# Altium schematic sheet POWER_SUPPLY.SchDoc
size A4
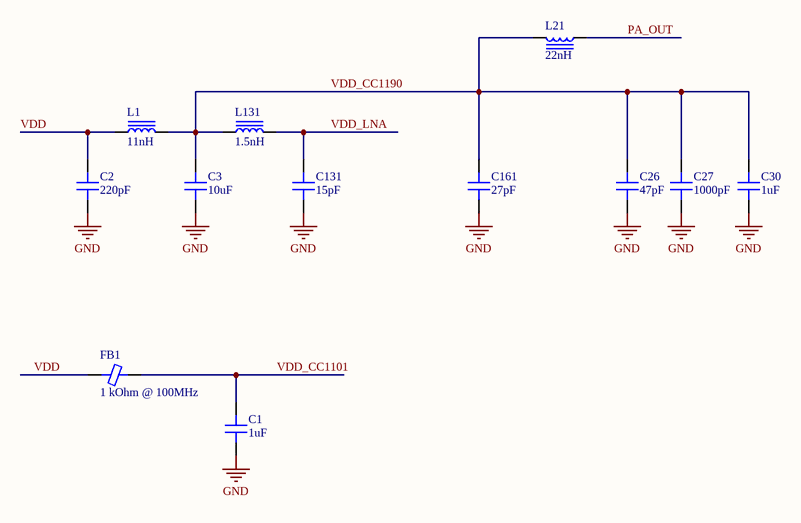
[diagram p0: POWER_SUPPLY.SchDoc]

## Parts
C1  1uF  [CAP 0402/1005]
C2  220pF  [CAP 0402/1005]
C3  10uF  [CAP 0402/1005]
C26  47pF  [CAP 0402/1005]
C27  1000pF  [CAP 0402/1005]
C30  1uF  [CAP 0402/1005]
C131  15pF  [CAP 0402/1005]
C161  27pF  [CAP 0402/1005]
FB1  1 kOhm @ 100MHz  [FER 0402/1005]
L1  11nH  [IND 0402/1005 RF WW]
L21  22nH  [IND 0402/1005 RF WW]
L131  1.5nH  [IND 0402/1005 RF WW]

## Nets
GND: C1.1 C2.1 C3.1 C26.1 C27.1 C30.1 C131.1 C161.1
PA_OUT: L21.1
VDD: C2.2 FB1.1 L1.1
VDD_CC1101: C1.2 FB1.2
VDD_CC1190: C3.2 C26.2 C27.2 C30.2 C161.2 L1.2 L21.2 L131.1
VDD_LNA: C131.2 L131.2

## Library data of the parts
C1 C30 = GRM155R60J105KE19D: CAP CER 1UF 6.3V X5R 0402; Manufacturer: Murata Electronics North America; TemperatureRange: -55C ~ 85C; Tolerance: 10%; Value: 1uF; Part Number: GRM155R60J105KE19D; PartId: 12330; Supplier 1: Digi-Key; Supplier Part Number 1: 490-1320-2-ND; ComponentLink1Description: Datasheet; ComponentLink1URL: http://www.murata.com/~/media/webrenewal/support/library/catalog/products/capacitor/mlcc/c02e.pdf; ComponentLink2Description: Digi-Key Listing; ComponentLink2URL: https://www.digikey.com/product-detail/en/murata-electronics-north-america/GRM155R60J105KE19D/490-1320-2-ND/587208; TemperatureCoefficient: X5R; Voltage: 6.3V; Price: 0,006; Device Package: 0402 (1005 Metric)
C2 = GCM1555C1H221JA16D: CAP CER 220PF 50V NP0 0402; Manufacturer: Murata Electronics North America; TemperatureRange: -55C ~ 125C; TemperatureCoefficient: C0G, NP0; Tolerance: 5%; Value: 220pF; Part Number: GCM1555C1H221JA16D; PartId: 12828; Supplier 1: Digi-Key; Supplier Part Number 1: 490-4927-2-ND; ComponentLink1Description: Datasheet; ComponentLink1URL: http://www.murata.com/~/media/webrenewal/support/library/catalog/products/capacitor/mlcc/c03e.ashx; ComponentLink2Description: Digi-Key Listing; ComponentLink2URL: https://www.digikey.com/product-detail/en/murata-electronics-north-america/GCM1555C1H221JA16D/490-4927-2-ND/1765175; Voltage: 50V; Price: 0,0109; Device Package: 0402 (1005 Metric)
C3 = C1005X5R0J106M050BC: CAP CER 10UF 6.3V X5R 0402; Manufacturer: TDK Corporation; TemperatureRange: -55C ~ 85C; Tolerance: 20%; Value: 10uF; Part Number: C1005X5R0J106M050BC; PartId: 12380; Supplier 1: Digi-Key; Supplier Part Number 1: 445-8920-2-ND; ComponentLink1Description: Datasheet; ComponentLink1URL: https://product.tdk.com/info/en/catalog/datasheets/mlcc_commercial_general_en.pdf; ComponentLink2Description: Digi-Key Listing; ComponentLink2URL: https://www.digikey.com/product-detail/en/tdk-corporation/C1005X5R0J106M050BC/445-8920-2-ND/3507809; TemperatureCoefficient: X5R; Voltage: 6.3V; Price: 0,119; Device Package: 0402 (1005 Metric)
C26 = GRM1555C1H470JA01D: CAP CER 47PF 50V NP0 0402; Manufacturer: Murata Electronics North America; TemperatureRange: -55C ~ 125C; TemperatureCoefficient: C0G, NP0; Tolerance: 5%; Value: 47pF; Part Number: GRM1555C1H470JA01D; PartId: 4827; Supplier 1: Digi-Key; Supplier Part Number 1: 490-5942-2-ND; ComponentLink1Description: Datasheet; ComponentLink1URL: http://www.murata.com/~/media/webrenewal/support/library/catalog/products/capacitor/mlcc/c02e.ashx; ComponentLink2Description: Digi-Key listing; ComponentLink2URL: http://digikey.com/product-detail/en/GRM1555C1H470JA01D/490-5942-2-ND/3693853; Voltage: 50V; Price: 0,0033; Type: -; Device Package: 0402 (1005 Metric)
C27 = GRM1555C1H102JA01D: CAP CER 1000PF 50V NP0 0402; Manufacturer: Murata Electronics North America; TemperatureRange: -55C ~ 125C; TemperatureCoefficient: C0G, NP0; Tolerance: 5%; Value: 1000pF; Part Number: GRM1555C1H102JA01D; PartId: 5126; Supplier 1: Digi-Key; Supplier Part Number 1: 490-3244-2-ND; ComponentLink1Description: Datasheet; ComponentLink1URL: http://www.murata.com/~/media/webrenewal/support/library/catalog/products/capacitor/mlcc/c02e.ashx; ComponentLink2Description: Digi-Key listing; ComponentLink2URL: http://digikey.com/product-detail/en/GRM1555C1H102JA01D/490-3244-2-ND/702509; Voltage: 50V; Price: 0,0164; Type: -; Device Package: 0402 (1005 Metric)
C131 = GRM1555C1H150JA01D: CAP CER 15PF 50V NP0 0402; Manufacturer: Murata Electronics North America; TemperatureRange: -55C ~ 125C; TemperatureCoefficient: C0G, NP0; Tolerance: 5%; Value: 15pF; Part Number: GRM1555C1H150JA01D; PartId: 4811; Supplier 1: Digi-Key; Supplier Part Number 1: 490-5888-2-ND; ComponentLink1Description: Datasheet; ComponentLink1URL: http://www.murata.com/~/media/webrenewal/support/library/catalog/products/capacitor/mlcc/c02e.ashx; ComponentLink2Description: Digi-Key listing; ComponentLink2URL: http://digikey.com/product-detail/en/GRM1555C1H150JA01D/490-5888-2-ND/2791374; Voltage: 50V; Price: 0,0032; Type: -; Device Package: 0402 (1005 Metric)
C161 = GRM1555C1H270JA01D: CAP CER 27PF 50V NP0 0402; Manufacturer: Murata Electronics North America; TemperatureRange: -55C ~ 125C; TemperatureCoefficient: C0G, NP0; Tolerance: 5%; Value: 27pF; Part Number: GRM1555C1H270JA01D; PartId: 4852; Supplier 1: Digi-Key; Supplier Part Number 1: 490-5869-2-ND; ComponentLink1Description: Datasheet; ComponentLink1URL: http://www.murata.com/~/media/webrenewal/support/library/catalog/products/capacitor/mlcc/c02e.ashx; ComponentLink2Description: Digi-Key listing; ComponentLink2URL: http://digikey.com/product-detail/en/GRM1555C1H270JA01D/490-5869-2-ND/3175188; Voltage: 50V; Price: 0,0053; Type: -; Device Package: 0402 (1005 Metric)
FB1 = BLM15HD102SN1D: FERRITE CHIP 1000 OHM 250MA 0402; Manufacturer: Murata Electronics North America; Type: Differential Mode - Single; DC Resistance: 1.25 Ohm Max; Part Number: BLM15HD102SN1D; PartId: 6552; Value: 1 kOhm @ 100MHz; Supplier 1: Digi-Key; Supplier Part Number 1: 490-4003-2-ND; ComponentLink1Description: Datasheet; ComponentLink1URL: http://search.murata.co.jp/Ceramy/image/img/PDF/ENG/L0110S0101BLM15H.pdf; ComponentLink2Description: Digi-Key listing; ComponentLink2URL: http://digikey.com/product-detail/en/BLM15HD102SN1D/490-4003-2-ND/1016162; Price: 0,073; Device Package: 0402 (1005 Metric); Current Rating: 250mA
L1 = LQW15AN11NJ00D: FIXED IND 11NH 500MA 140 MOHM; Manufacturer: Murata Electronics North America; TemperatureRange: -55C ~ 125C; Tolerance: 5%; Type: Wirewound; Q at Frequency: 30 @ 250MHz; DC Resistance: 140 mOhm Max; Shielding: Unshielded; Value: 11nH; Part Number: LQW15AN11NJ00D; PartId: 6366; Supplier 1: Digi-Key; Supplier Part Number 1: 490-6766-2-ND; ComponentLink1Description: Datasheet; ComponentLink1URL: http://search.murata.co.jp/Ceramy/image/img/PDF/ENG/L0075S0080LQW15A_00.pdf; ComponentLink2Description: Digi-Key listing; ComponentLink2URL: http://digikey.com/product-detail/en/LQW15AN11NJ00D/490-6766-2-ND/2594850; Price: 0,0733; Device Package: 0402 (1005 Metric)
L21 = LQW15AN22NH00D: FIXED IND 22NH 310MA 300 MOHM; Manufacturer: Murata Electronics North America; TemperatureRange: -55C ~ 125C; Tolerance: 3%; Type: Wirewound; Q at Frequency: 25 @ 250MHz; DC Resistance: 300 mOhm Max; Shielding: Unshielded; Value: 22nH; Part Number: LQW15AN22NH00D; PartId: 6378; Supplier 1: Digi-Key; Supplier Part Number 1: 490-6788-2-ND; ComponentLink1Description: Datasheet; ComponentLink1URL: http://search.murata.co.jp/Ceramy/image/img/PDF/ENG/L0075S0080LQW15A_00.pdf; ComponentLink2Description: Digi-Key listing; ComponentLink2URL: http://digikey.com/product-detail/en/LQW15AN22NH00D/490-6788-2-ND/2594873; Price: 0,077; Device Package: 0402 (1005 Metric)
L131 = LQW15AN1N5D00D: FIXED IND 1.5NH 1A 30 MOHM 0402; Manufacturer: Murata Electronics North America; TemperatureRange: -55C ~ 125C; Tolerance: 0.5nH; Type: Wirewound; Q at Frequency: 10 @ 250MHz; DC Resistance: 30 mOhm Max; Shielding: Unshielded; Value: 1.5nH; Part Number: LQW15AN1N5D00D; PartId: 6359; Supplier 1: Digi-Key; Supplier Part Number 1: 490-1136-2-ND; ComponentLink1Description: Datasheet; ComponentLink1URL: http://search.murata.co.jp/Ceramy/image/img/PDF/ENG/L0075S0080LQW15A_00.pdf; ComponentLink2Description: Digi-Key listing; ComponentLink2URL: http://digikey.com/product-detail/en/LQW15AN1N5D00D/490-1136-2-ND/584345; Price: 0,0689; Device Package: 0402 (1005 Metric)